# Altium schematic sheet [03] - POWER DIAGRAM.SchDoc: POWER DIAGRAM
size A; SheetNumber: 3; SheetTotal: 5
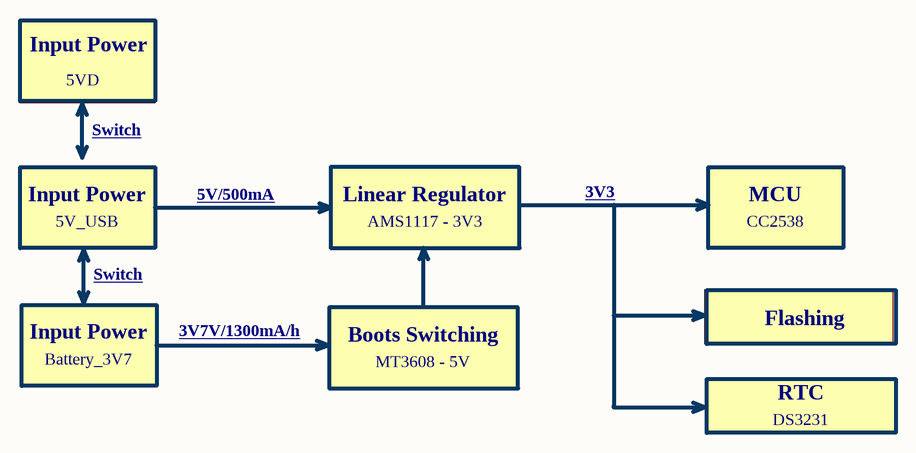
[diagram p0: [03] - POWER DIAGRAM.SchDoc]

## Notes on the sheet
- 5VD
- Input Power
- Switch
- 5V_USB
- 5V/500mA
- Linear Regulator
- AMS1117 - 3V3
- 3V3
- MCU
- CC2538
- 3V7V/1300mA/h
- Boots Switching
- Flashing
- Battery_3V7
- MT3608 - 5V
- RTC
- DS3231